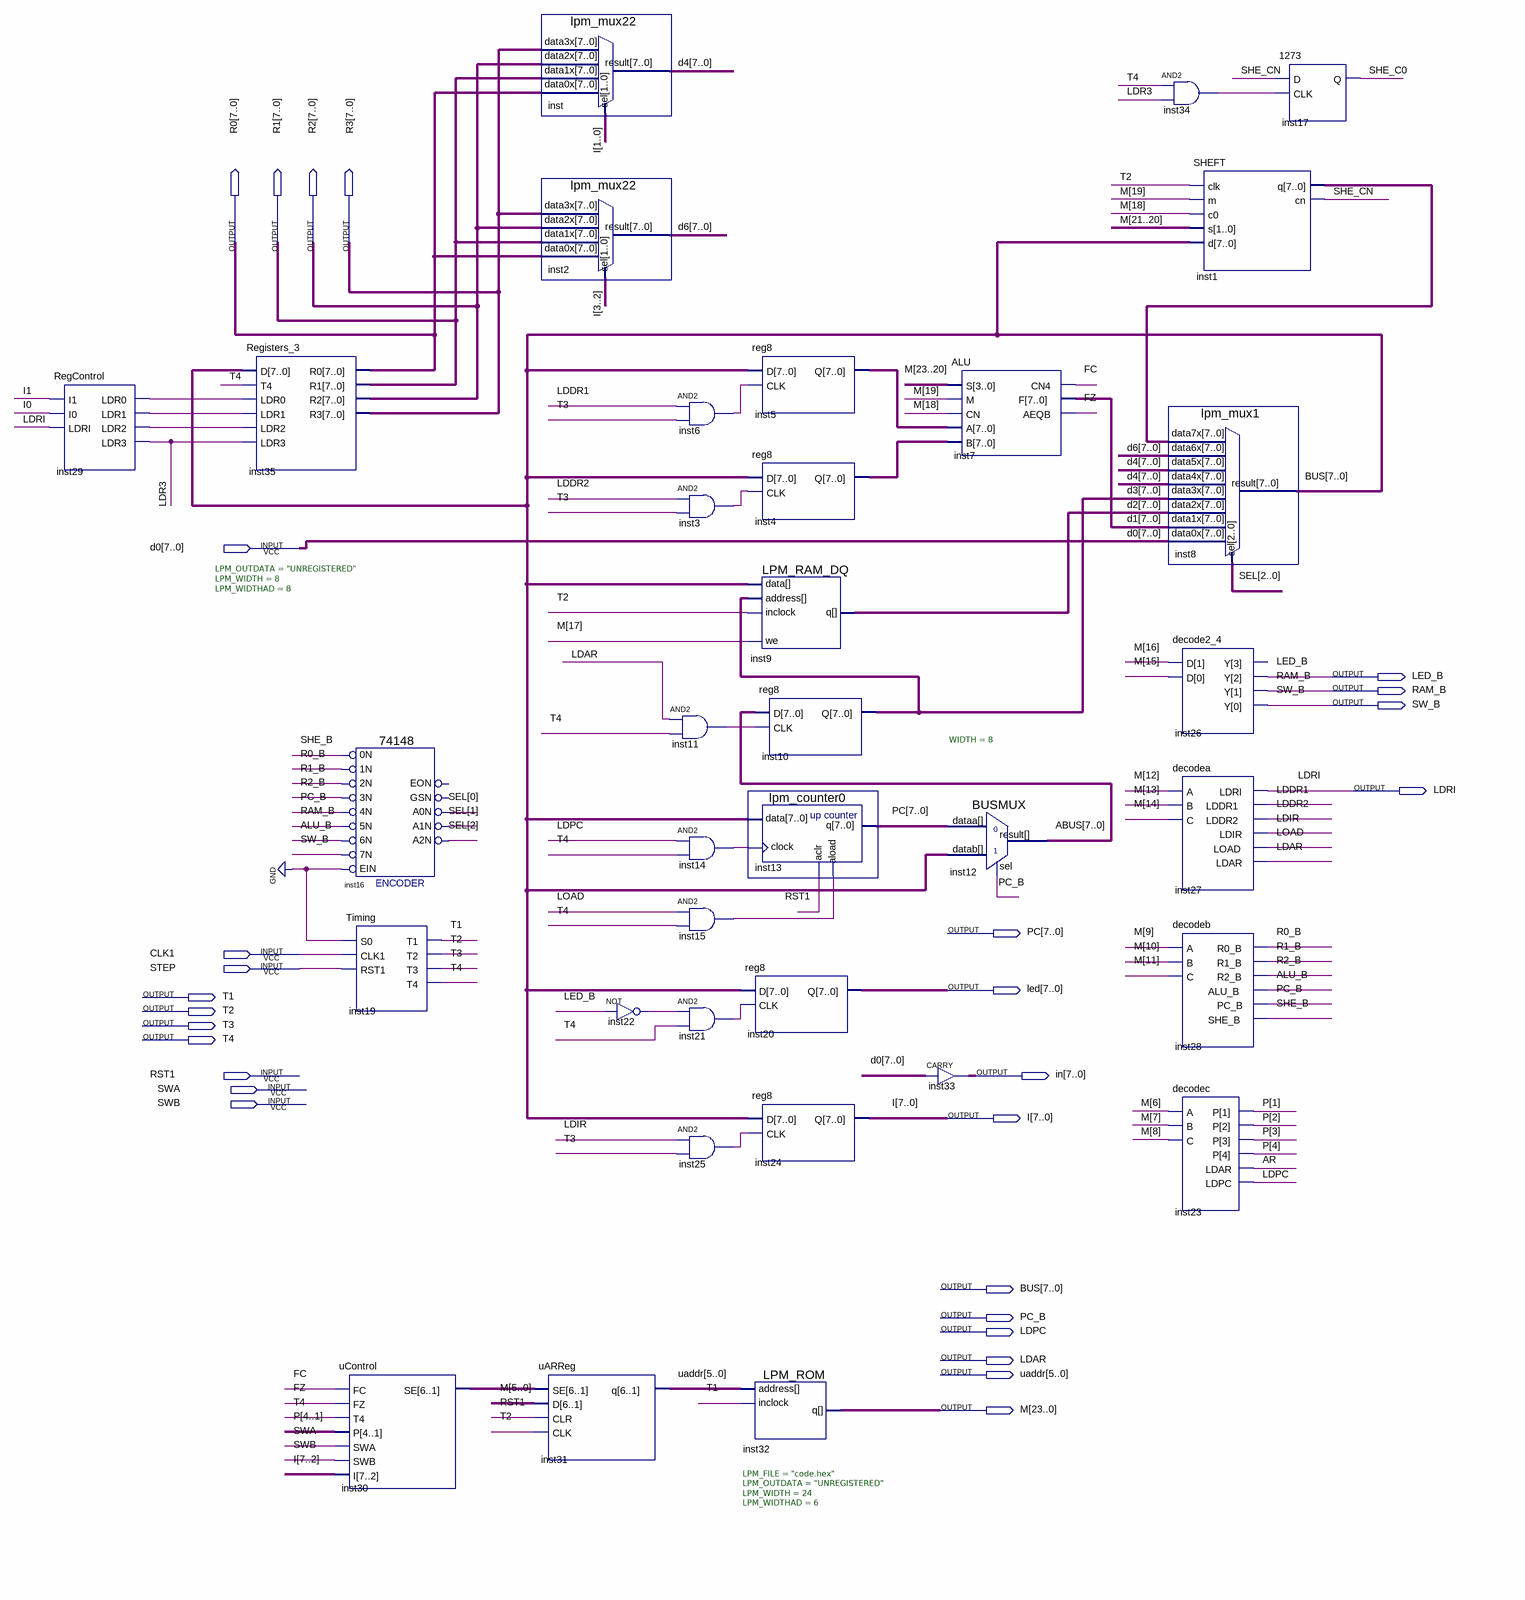
[diagram p0: schematic sheet]
// Quartus schematic Computer.bdf as structural Verilog: 35 symbols, 28 pins
module Computer (
  input  [7:0] d0,
  input  CLK1,
  input  STEP,
  input  RST1,
  input  SWA,
  input  SWB,
  output [7:0] R0,
  output [7:0] R1,
  output [7:0] R2,
  output [7:0] R3,
  output LED_B,
  output RAM_B,
  output SW_B,
  output LDRI,
  output [7:0] PC,
  output [7:0] led,
  output T1,
  output T2,
  output T3,
  output T4,
  output [7:0] in,
  output [7:0] I,
  output [7:0] BUS,
  output PC_B,
  output LDPC,
  output LDAR,
  output [5:0] uaddr,
  output [23:0] M
);

  wire ALU_B, AR, FC, FZ, inst3_out, inst6_out, inst11_out, inst14_out, inst15_out, inst21_out, inst22_out,
       inst25_out, inst29_ldr0, inst29_ldr1, inst29_ldr2, inst34_out, LDDR1, LDDR2, LDIR, LDR3, LOAD, R0_B,
       R1_B, R2_B, SHE_B, SHE_C0, SHE_CN;
  wire [2:0] SEL;
  wire [4:1] P;
  wire [5:0] inst30_se;
  wire [7:0] ABUS, d1, d2, d3, d4, d6, inst1_q, inst4_q, inst5_q;
  wire [3:0] inst26_y_open;  // unused outputs

  RegControl inst29 (
    .I1(I[1]), .I0(I[0]), .LDRI(LDRI), .LDR0(inst29_ldr0), .LDR1(inst29_ldr1), .LDR2(inst29_ldr2), .LDR3(LDR3));
  Registers_3 inst35 (
    .D(BUS), .T4(T4), .LDR0(inst29_ldr0), .LDR1(inst29_ldr1), .LDR2(inst29_ldr2), .LDR3(LDR3), .R0(R0),
    .R1(R1), .R2(R2), .R3(R3));
  \74148  inst16 (
    .\5N (RAM_B), .\0N (SHE_B), .\1N (R0_B), .\2N (R1_B), .\3N (R2_B), .\4N (PC_B), .EIN(1'b0), .\6N (ALU_B),
    .\7N (SW_B), .A1N(SEL[1]), .A0N(SEL[0]), .A2N(SEL[2]));  // open: EON, GSN
  Timing inst19 (.S0(1'b0), .CLK1(CLK1), .RST1(STEP), .T1(T1), .T2(T2), .T3(T3), .T4(T4));
  uControl inst30 (.FC(FC), .FZ(FZ), .T4(T4), .P(P), .SWA(SWA), .SWB(SWB), .I(I[7:2]), .SE(inst30_se));
  lpm_mux22 inst (.data3x(R3), .data2x(R2), .data1x(R1), .data0x(R0), .sel(I[1:0]), .result(d4));
  lpm_mux22 inst2 (.data3x(R3), .data2x(R2), .data1x(R1), .data0x(R0), .sel(I[3:2]), .result(d6));
  uARReg inst31 (.SE(inst30_se), .D(M[5:0]), .CLR(RST1), .CLK(T2), .q(uaddr));
  not inst22 (inst22_out, LED_B);
  and inst6 (inst6_out, LDDR1, T3);
  and inst3 (inst3_out, LDDR2, T3);
  and inst11 (inst11_out, LDAR, T4);
  and inst14 (inst14_out, LDPC, T4);
  and inst15 (inst15_out, LOAD, T4);
  and inst21 (inst21_out, inst22_out, T4);
  and inst25 (inst25_out, LDIR, T3);
  reg8 inst20 (.D(BUS), .CLK(inst21_out), .Q(led));
  LPM_ROM #(.LPM_FILE("code.hex"), .LPM_OUTDATA("UNREGISTERED"), .LPM_WIDTH(24), .LPM_WIDTHAD(6)) inst32 (
    .address(uaddr), .inclock(T1), .q(M));
  reg8 inst5 (.D(BUS), .CLK(inst6_out), .Q(inst5_q));
  reg8 inst4 (.D(BUS), .CLK(inst3_out), .Q(inst4_q));
  LPM_RAM_DQ #(.LPM_OUTDATA("UNREGISTERED"), .LPM_WIDTH(8), .LPM_WIDTHAD(8)) inst9 (
    .inclock(T2), .data(BUS), .address(d3), .we(M[17]), .q(d2));
  reg8 inst10 (.D(ABUS), .CLK(inst11_out), .Q(d3));
  lpm_counter0 inst13 (.data(BUS), .clock(inst14_out), .aclr(RST1), .aload(inst15_out), .q(PC));
  reg8 inst24 (.D(BUS), .CLK(inst25_out), .Q(I));
  ALU inst7 (.S(M[23:20]), .M(M[19]), .CN(M[18]), .A(inst5_q), .B(inst4_q), .CN4(FC), .F(d1), .AEQB(FZ));
  BUSMUX #(.WIDTH(8)) inst12 (.datab(BUS), .sel(PC_B), .dataa(PC), .result(ABUS));
  CARRY inst33[7:0] (.IN(d0), .OUT(in));
  and inst34 (inst34_out, T4, LDR3);
  SHEFT inst1 (.clk(T2), .m(M[19]), .c0(M[18]), .s(M[21:20]), .d(BUS), .q(inst1_q), .cn(SHE_CN));
  lpm_mux1 inst8 (
    .data7x(inst1_q), .data6x(d6), .data5x(d4), .data4x(d4), .data3x(d3), .data2x(d2), .data1x(d1),
    .data0x(d0), .sel(SEL), .result(BUS));
  decode2_4 inst26 (.D(M[16:15]), .Y({inst26_y_open[3], LED_B, RAM_B, SW_B}));
  decodea inst27 (
    .A(M[12]), .B(M[13]), .C(M[14]), .LDRI(LDRI), .LDDR1(LDDR1), .LDDR2(LDDR2), .LDIR(LDIR), .LOAD(LOAD),
    .LDAR(LDAR));
  decodeb inst28 (
    .A(M[9]), .B(M[10]), .C(M[11]), .R0_B(R0_B), .R1_B(R1_B), .R2_B(R2_B), .ALU_B(ALU_B), .PC_B(PC_B),
    .SHE_B(SHE_B));
  decodec inst23 (.A(M[6]), .B(M[7]), .C(M[8]), .P(P), .LDAR(AR), .LDPC(LDPC));
  \1273  inst17 (.CLK(inst34_out), .D(SHE_CN), .Q(SHE_C0));
endmodule
